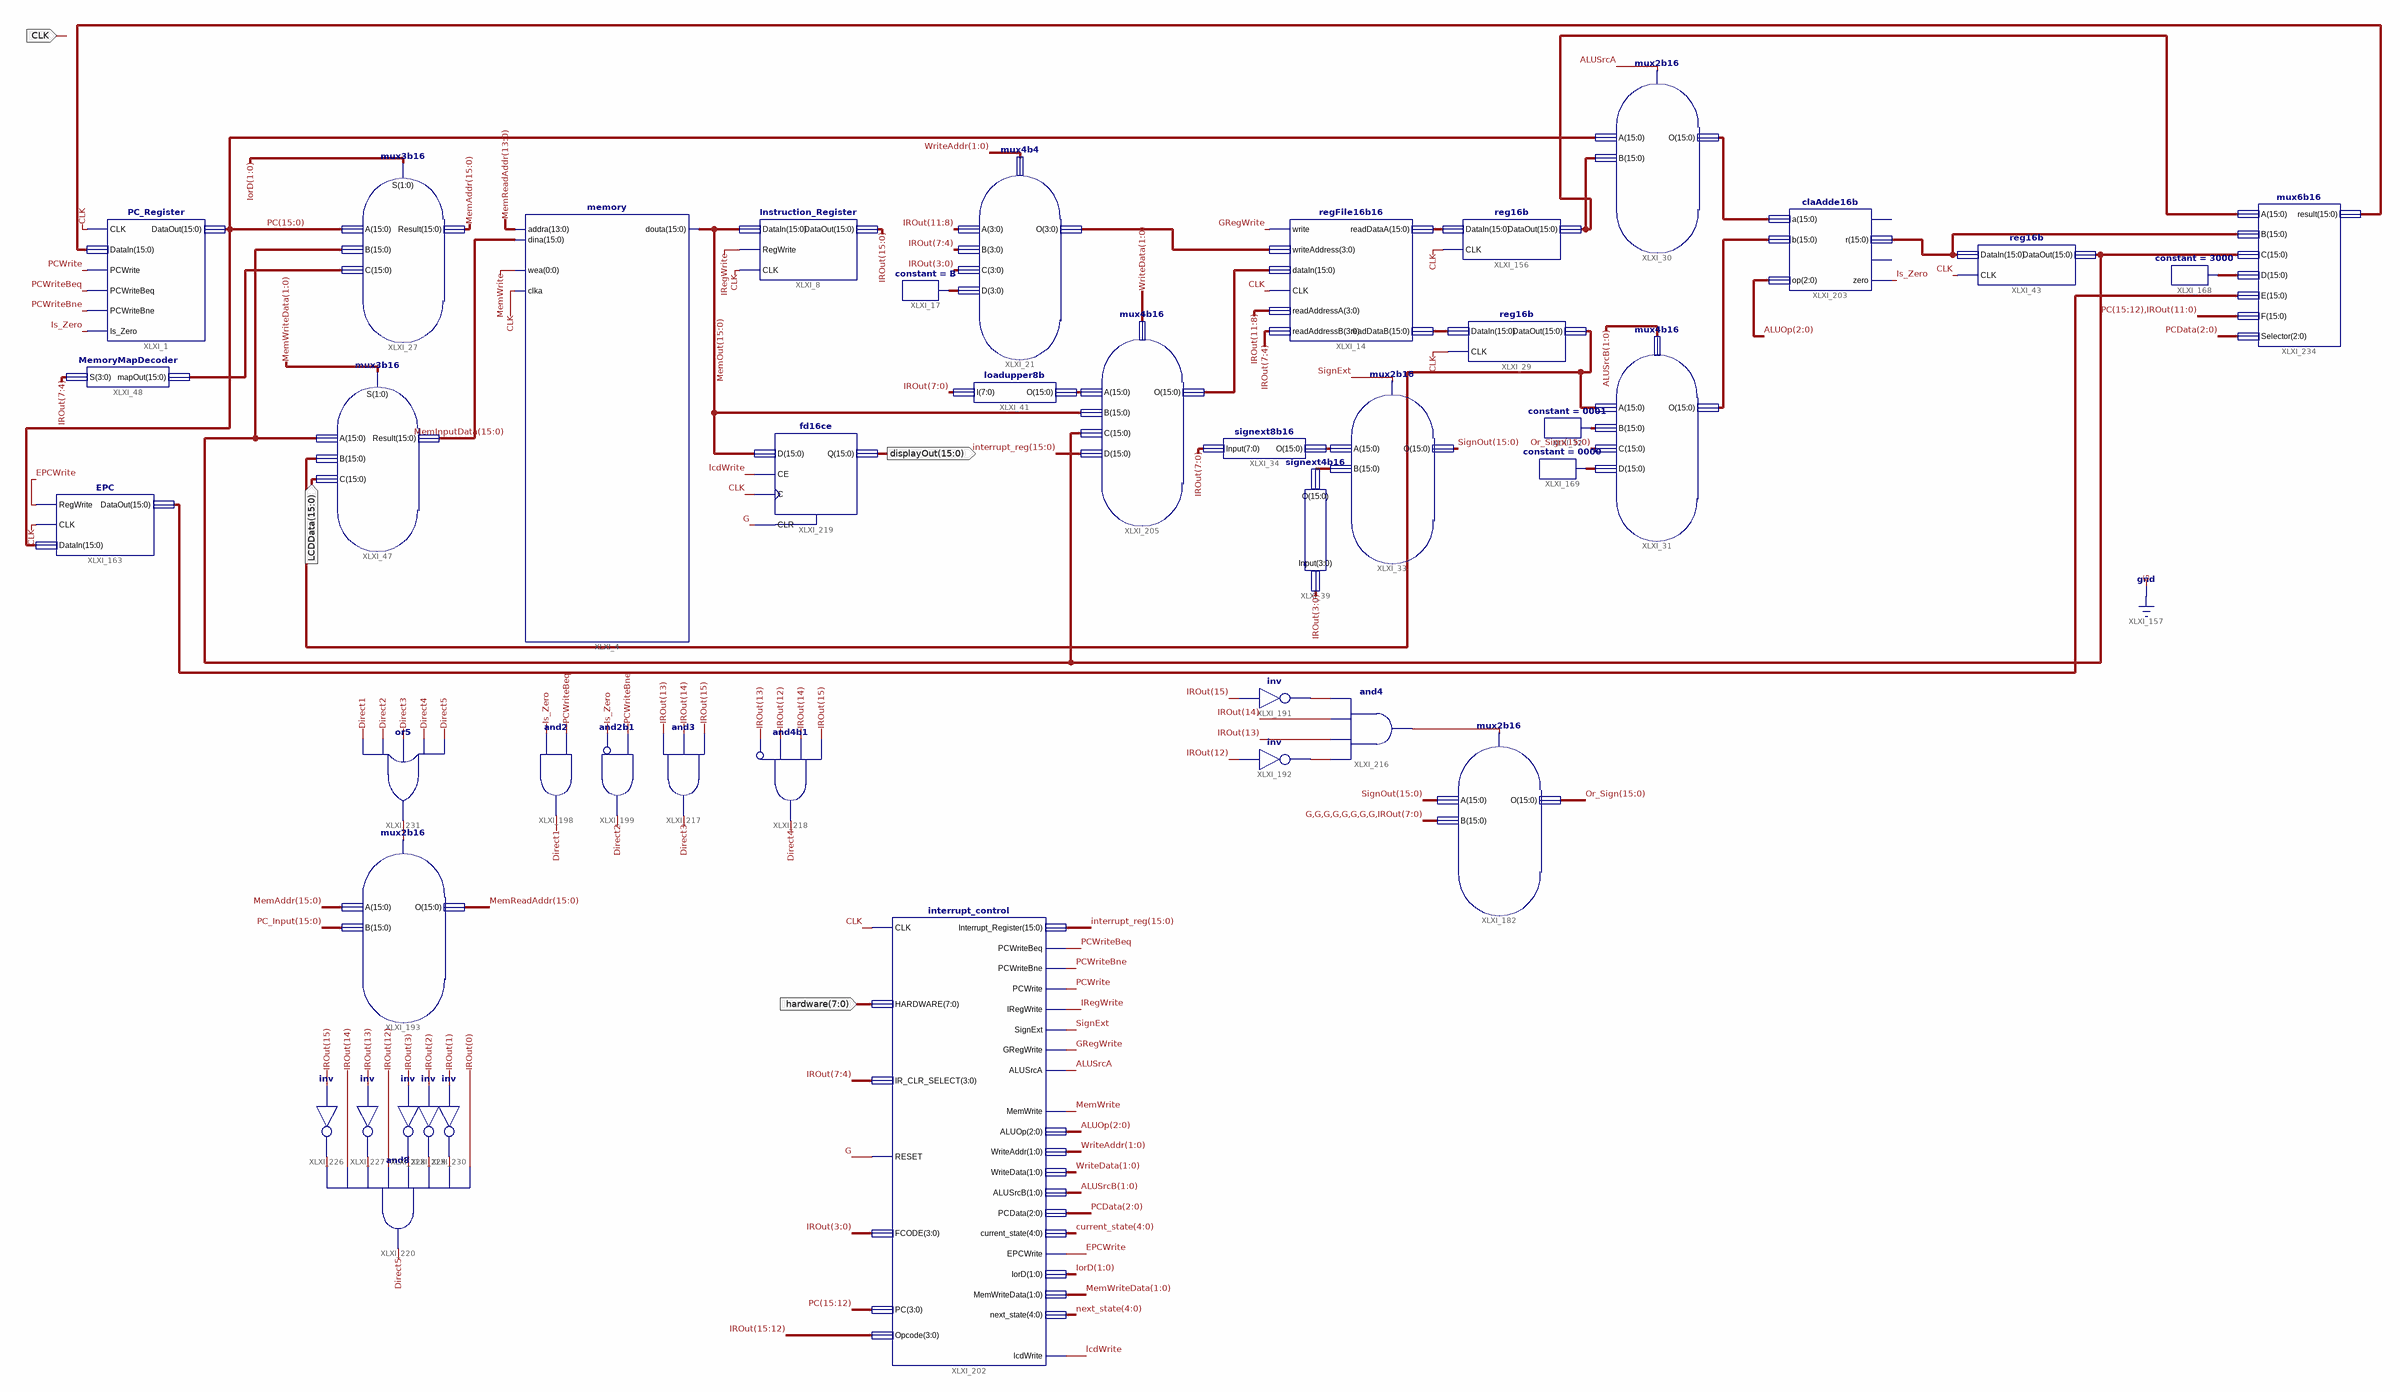
[diagram p0: schematic sheet 1]
// Xilinx ISE schematic Final_Data_Path.sch (spartan3e) as structural Verilog: 43 symbols, 4 ports
module Final_Data_Path (
  input  CLK,
  input  [15:0] LCDData,
  input  [7:0] hardware,
  output [15:0] displayOut
);

  wire ALUSrcA, Direct1, Direct2, Direct3, Direct4, Direct5, EPCWrite, GRegWrite, IRegWrite, Is_Zero,
       lcdWrite, MemWrite, PCWrite, PCWriteBeq, PCWriteBne, SignExt, XLXN_303, XLXN_332, XLXN_334, XLXN_341,
       XLXN_348, XLXN_349, XLXN_350, XLXN_351, XLXN_352;
  wire [1:0] ALUSrcB, IorD, MemWriteData, WriteAddr, WriteData;
  wire [2:0] ALUOp, PCData;
  wire [3:0] WriteAddress, XLXN_261;
  wire [4:0] current_state, next_state;
  wire [15:0] A_Input, ALU_Out, ALU_outAfter, B_Input, interrupt_reg, IROut, MemAddr, MemInputData, MemOut,
       MemReadAddr, Or_Sign, PC, PC_Input, readDataA, SignOut, writeDataIn, XLXN_46, XLXN_47, XLXN_49,
       XLXN_50, XLXN_57, XLXN_64, XLXN_71, XLXN_110, XLXN_229, XLXN_254, XLXN_262;

  memory XLXI_4 (.addra(MemReadAddr[13:0]), .dina(MemInputData), .wea(MemWrite), .clka(CLK), .douta(MemOut));
  Instruction_Register XLXI_8 (.DataIn(MemOut), .RegWrite(IRegWrite), .CLK(CLK), .DataOut(IROut));
  mux4b4 XLXI_21 (.O(WriteAddress), .B(IROut[7:4]), .C(IROut[3:0]), .D(XLXN_261), .A(IROut[11:8]), .S(WriteAddr));
  regFile16b16 XLXI_14 (
    .write(GRegWrite), .writeAddress(WriteAddress), .dataIn(writeDataIn), .CLK(CLK),
    .readAddressA(IROut[11:8]), .readAddressB(IROut[7:4]), .readDataB(XLXN_46), .readDataA(readDataA));
  reg16b XLXI_29 (.DataIn(XLXN_46), .CLK(CLK), .DataOut(XLXN_49));
  constant #(.CValue("0001")) XLXI_32 (.O(XLXN_50));
  mux4b16 XLXI_31 (.A(XLXN_49), .B(XLXN_50), .C(Or_Sign), .D(XLXN_262), .O(B_Input), .S(ALUSrcB));
  mux2b16 XLXI_33 (.A(XLXN_57), .B(XLXN_64), .O(SignOut), .S(SignExt));
  signext8b16 XLXI_34 (.Input(IROut[7:0]), .O(XLXN_57));
  signext4b16 XLXI_39 (.Input(IROut[3:0]), .O(XLXN_64));
  mux2b16 XLXI_30 (.A(PC), .B(XLXN_47), .O(A_Input), .S(ALUSrcA));
  loadupper8b XLXI_41 (.I(IROut[7:0]), .O(XLXN_71));
  PC_Register XLXI_1 (
    .CLK(CLK), .DataIn(PC_Input), .PCWrite(PCWrite), .PCWriteBeq(PCWriteBeq), .PCWriteBne(PCWriteBne),
    .Is_Zero(Is_Zero), .DataOut(PC));
  mux3b16 XLXI_47 (.A(ALU_outAfter), .B(XLXN_49), .C(LCDData), .Result(MemInputData), .S(MemWriteData));
  reg16b XLXI_43 (.DataIn(ALU_Out), .CLK(CLK), .DataOut(ALU_outAfter));
  MemoryMapDecoder XLXI_48 (.S(IROut[7:4]), .mapOut(XLXN_110));
  mux3b16 XLXI_27 (.A(PC), .B(ALU_outAfter), .C(XLXN_110), .Result(MemAddr), .S(IorD));
  reg16b XLXI_156 (.DataIn(readDataA), .CLK(CLK), .DataOut(XLXN_47));
  EPC XLXI_163 (.RegWrite(EPCWrite), .CLK(CLK), .DataIn(PC), .DataOut(XLXN_229));
  constant #(.CValue("3000")) XLXI_168 (.O(XLXN_254));
  constant #(.CValue("B")) XLXI_17 (.O(XLXN_261));
  constant #(.CValue("0000")) XLXI_169 (.O(XLXN_262));
  mux2b16 XLXI_182 (.A(SignOut), .B({{8{1'b0}}, IROut[7:0]}), .O(Or_Sign), .S(XLXN_341));
  mux2b16 XLXI_193 (.A(MemAddr), .B(PC_Input), .O(MemReadAddr), .S(XLXN_303));
  and XLXI_198 (Direct1, Is_Zero, PCWriteBeq);
  and XLXI_199 (Direct2, ~Is_Zero, PCWriteBne);  // and2b1
  interrupt_control XLXI_202 (
    .CLK(CLK), .HARDWARE(hardware), .IR_CLR_SELECT(IROut[7:4]), .RESET(1'b0), .Opcode(IROut[15:12]),
    .FCODE(IROut[3:0]), .PC(PC[15:12]), .Interrupt_Register(interrupt_reg), .PCWriteBeq(PCWriteBeq),
    .PCWriteBne(PCWriteBne), .PCWrite(PCWrite), .IRegWrite(IRegWrite), .SignExt(SignExt),
    .GRegWrite(GRegWrite), .ALUSrcA(ALUSrcA), .MemWrite(MemWrite), .ALUOp(ALUOp), .WriteAddr(WriteAddr),
    .WriteData(WriteData), .ALUSrcB(ALUSrcB), .PCData(PCData), .current_state(current_state),
    .EPCWrite(EPCWrite), .IorD(IorD), .MemWriteData(MemWriteData), .next_state(next_state),
    .lcdWrite(lcdWrite));
  claAdde16b XLXI_203 (.a(A_Input), .b(B_Input), .op(ALUOp), .r(ALU_Out), .zero(Is_Zero));  // open: c_out, overflow
  mux4b16 XLXI_205 (.A(XLXN_71), .B(MemOut), .C(ALU_outAfter), .D(interrupt_reg), .O(writeDataIn), .S(WriteData));
  and XLXI_217 (Direct3, IROut[13], IROut[14], IROut[15]);
  and XLXI_218 (Direct4, ~IROut[13], IROut[12], IROut[14], IROut[15]);  // and4b1
  not XLXI_192 (XLXN_334, IROut[12]);
  not XLXI_191 (XLXN_332, IROut[15]);
  and XLXI_216 (XLXN_341, XLXN_334, IROut[13], IROut[14], XLXN_332);
  fd16ce XLXI_219 (.C(CLK), .CE(lcdWrite), .CLR(1'b0), .D(MemOut), .Q(displayOut));
  and XLXI_220 (Direct5, XLXN_348, IROut[14], XLXN_349, IROut[12], XLXN_350, XLXN_351, XLXN_352, IROut[0]);
  not XLXI_226 (XLXN_348, IROut[15]);
  not XLXI_227 (XLXN_349, IROut[13]);
  not XLXI_228 (XLXN_350, IROut[3]);
  not XLXI_229 (XLXN_351, IROut[2]);
  not XLXI_230 (XLXN_352, IROut[1]);
  or XLXI_231 (XLXN_303, Direct1, Direct2, Direct3, Direct4, Direct5);
  mux6b16 XLXI_234 (
    .A(XLXN_47), .B(ALU_Out), .C(ALU_outAfter), .D(XLXN_254), .E(XLXN_229), .F({PC[15:12], IROut[11:0]}),
    .Selector(PCData), .result(PC_Input));
endmodule
